# Altium schematic sheet Mini Control Board.SchDoc
size A3; PageSetup: Record=PageOptions|CenterHorizontal=True|CenterVertical=True|PrintScale=0.70|XCorrection=1.00|YCorrection=1.00|PrintKind=0|BorderSize=5000000|LeftOffset=0|BottomOffset=0|Orientation=2|PaperLength=1000|PaperWidth=1000|Scale=100|PaperSource=7|PrintQuality=-3|MediaType=1|DitherType=10|PrintScaleMode=1|PaperKind=Letter|PaperIndex=1
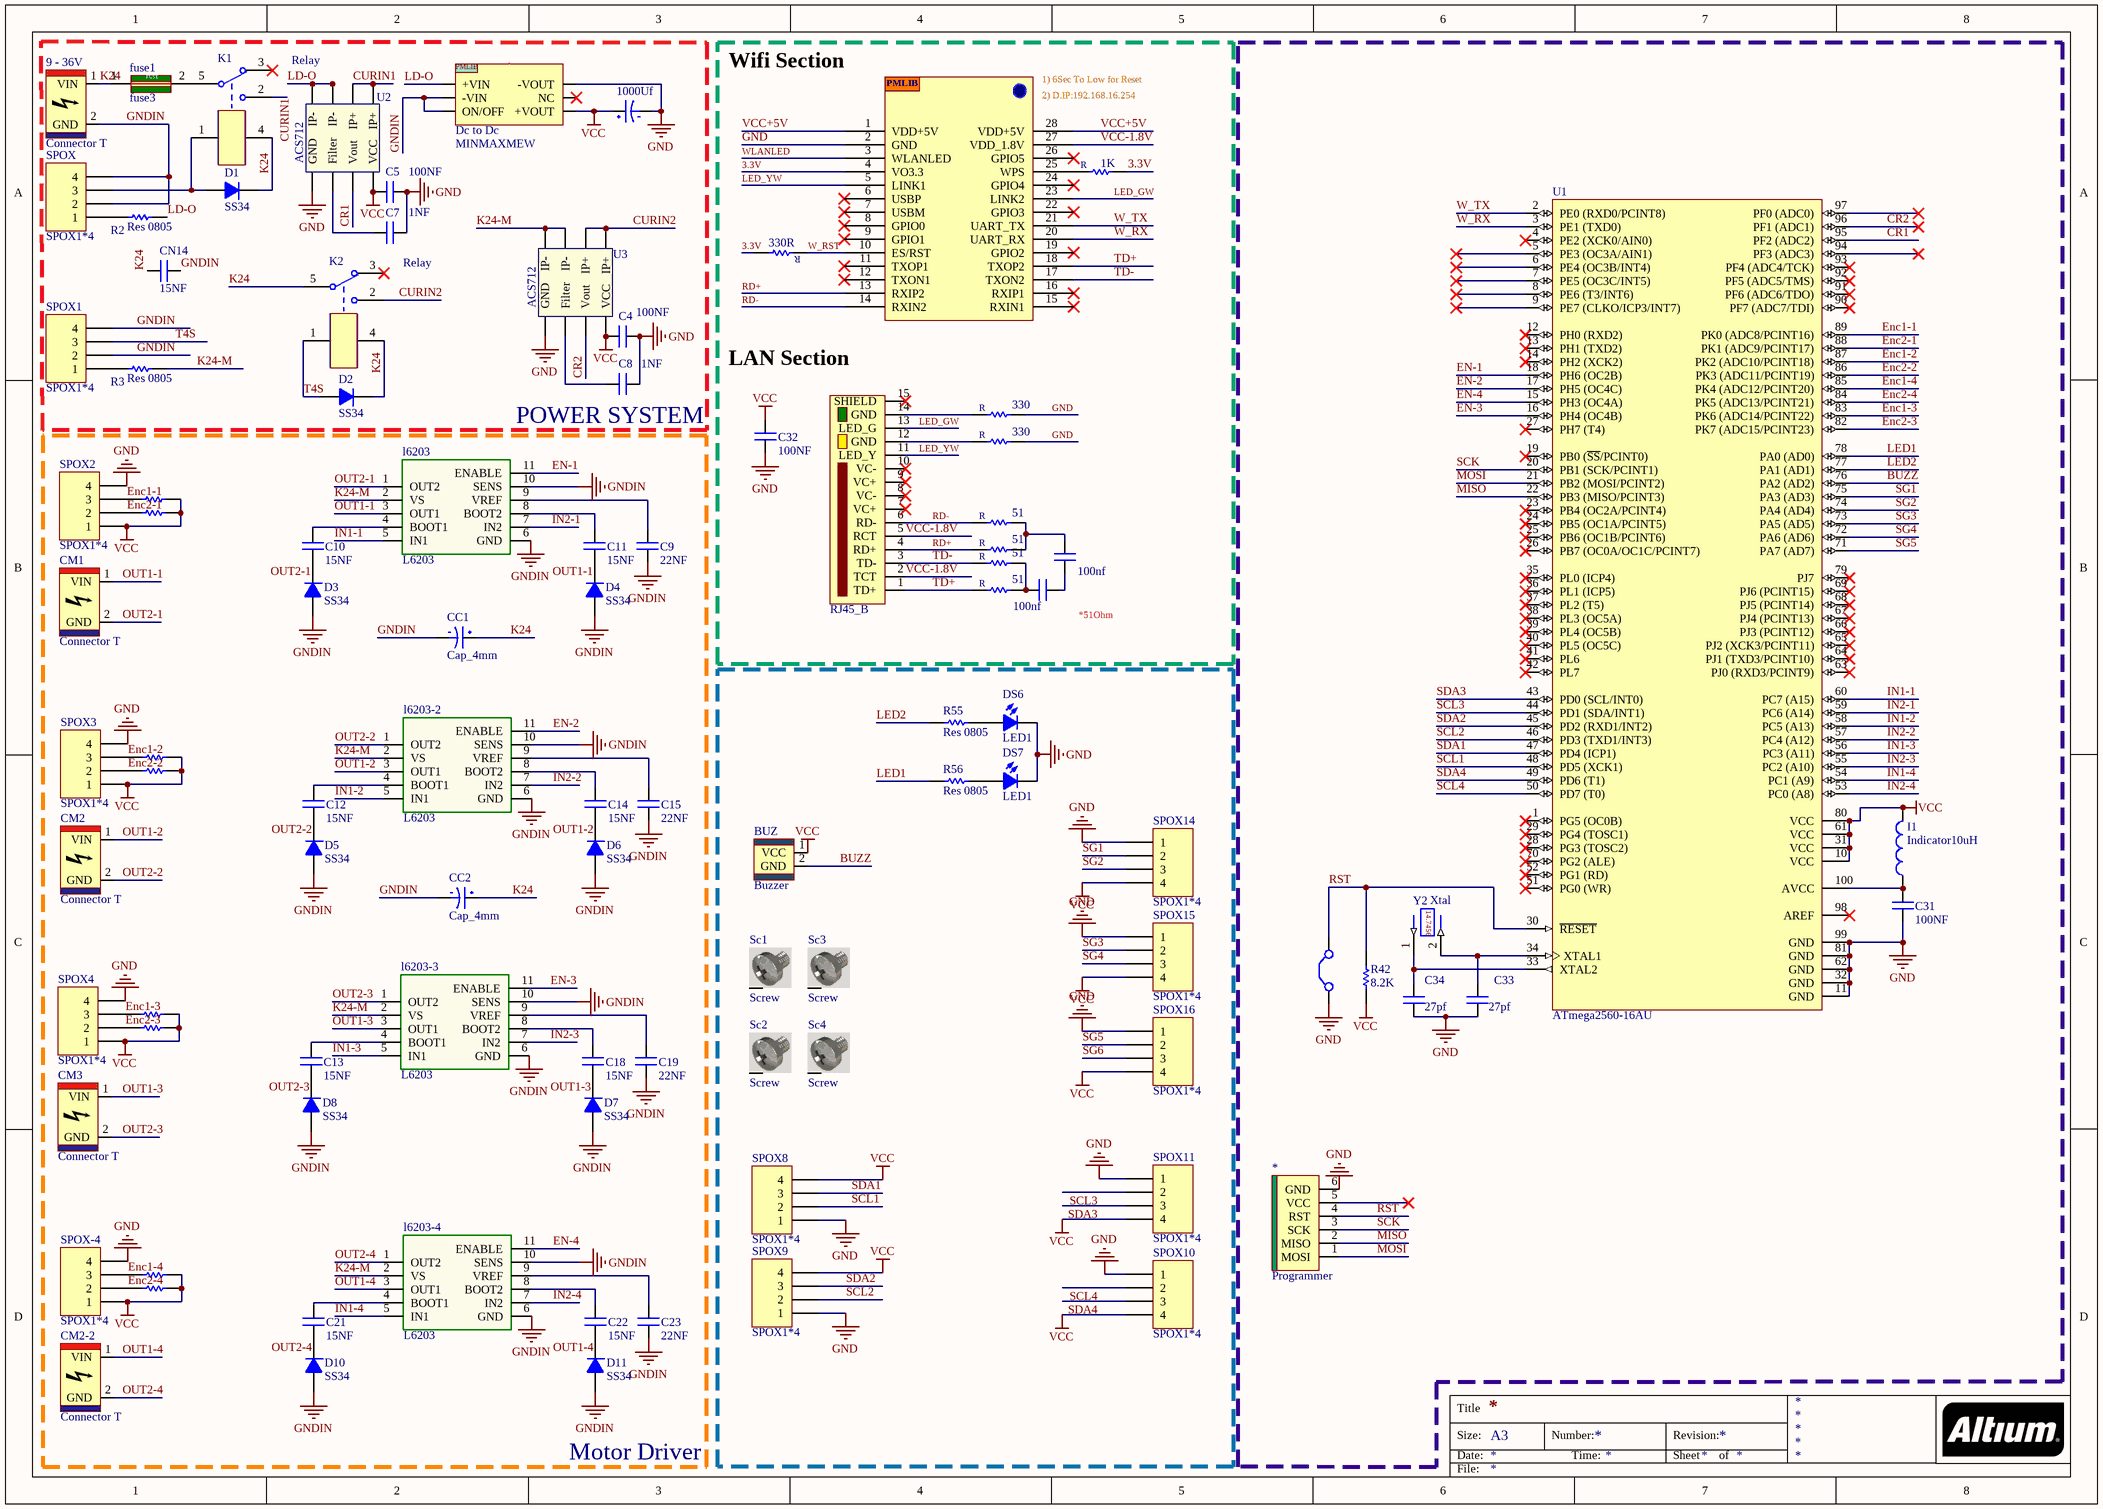
[diagram p0: Mini Control Board.SchDoc]

## Parts
3  HLK_WifiModule  [HLK]  (value not drawn)
9_-_36V  Connector T  [T_Connector]
34  330  [R0805]
35  330R  [R0805]
43  330  [R0805]
89  RJ45_B  [RJ45_B]
1000Uf  Cap_4mm  [Cap_4mm]  (value not drawn)
*  Programmer  [Programmer]
BUZ  Buzzer  [Buzzer]
C4  100NF  [Cap0805]
C5  100NF  [Cap0805]
C7  1NF  [Cap0805]
C8  1NF  [Cap0805]
C9  22NF  [Cap0805]
C10  15NF  [Cap0805]
C11  15NF  [Cap0805]
C12  15NF  [Cap0805]
C13  15NF  [Cap0805]
C14  15NF  [Cap0805]
C15  22NF  [Cap0805]
C18  15NF  [Cap0805]
C19  22NF  [Cap0805]
C21  15NF  [Cap0805]
C22  15NF  [Cap0805]
C23  22NF  [Cap0805]
C31  100NF  [Cap0805]
C32  100NF  [Cap0805]
C33  27pf  [Cap0805]
C34  27pf  [Cap0805]
C93  100nf  [Cap0805]
C94  100nf  [Cap0805]
CC1  Cap_4mm  [Cap_5mm]
CC2  Cap_4mm  [Cap_5mm]
CM1  Connector T  [T_Connector]
CM2  Connector T  [T_Connector]
CM2-2  Connector T  [T_Connector]
CM3  Connector T  [T_Connector]
CN14  15NF  [Cap0805]
D1  SS34  [Diod-1A-SMD]
D2  SS34  [Diod-1A-SMD]
D3  SS34  [Diod-1A-SMD]
D4  SS34  [Diod-1A-SMD]
D5  SS34  [Diod-1A-SMD]
D6  SS34  [Diod-1A-SMD]
D7  SS34  [Diod-1A-SMD]
D8  SS34  [Diod-1A-SMD]
D10  SS34  [Diod-1A-SMD]
D11  SS34  [Diod-1A-SMD]
Dc_to_Dc  MINMAXMEW  [MINMAXMEW]
DS6  LED1  [LED_SMD0805RED]
DS7  LED1  [LED_SMD0805RED]
fdcg3  Jumper  [Jumper]  (value not drawn)
fuse1  fuse3  [fuse_SMD0805]
I1  Indicator10uH  [1206]
K1  Relay  [RelayMilionMiniS-Z]
K2  Relay  [RelayMilionMiniS-Z]
l6203  L6203  [L6203]
l6203-2  L6203  [L6203]
l6203-3  L6203  [L6203]
l6203-4  L6203  [L6203]
PO  51  [R0805]
POS  51  [R0805]
POS2  51  [R0805]
POS3  51  [R0805]
POSWW  1K  [R0805]
R2  Res 0805  [R0805]
R3  Res 0805  [R0805]
R8  Res 0805  [R0805]  (value not drawn)
R9  Res 0805  [R0805]  (value not drawn)
R12  Res 0805  [R0805]  (value not drawn)
R13  Res 0805  [R0805]  (value not drawn)
R16  Res 0805  [R0805]  (value not drawn)
R17  Res 0805  [R0805]  (value not drawn)
R25  Res 0805  [R0805]  (value not drawn)
r26  Res 0805  [R0805]  (value not drawn)
R42  8.2K  [R0805]
R55  Res 0805  [R0805]
R56  Res 0805  [R0805]
Sc1  Screw  [Screw]
Sc2  Screw  [Screw]
Sc3  Screw  [Screw]
Sc4  Screw  [Screw]
SPOX  SPOX1*4  [SPOX_1*4RIGHT]
SPOX1  SPOX1*4  [SPOX_1*4RIGHT]
SPOX2  SPOX1*4  [SPOX_1*4RIGHT]
SPOX3  SPOX1*4  [SPOX_1*4RIGHT]
SPOX4  SPOX1*4  [SPOX_1*4RIGHT]
SPOX8  SPOX1*4  [SPOX_1*4RIGHT]
SPOX9  SPOX1*4  [SPOX_1*4RIGHT]
SPOX10  SPOX1*4  [SPOX_1*4RIGHT]
SPOX11  SPOX1*4  [SPOX_1*4RIGHT]
SPOX14  SPOX1*4  [SPOX_1*4RIGHT]
SPOX15  SPOX1*4  [SPOX_1*4RIGHT]
SPOX16  SPOX1*4  [SPOX_1*4RIGHT]
SPOX-4  SPOX1*4  [SPOX_1*4RIGHT]
U1  ATmega2560-16AU  [100A_N]
U2  ACS712  [SOP8]
U3  ACS712  [SOP8]
Y2  Xtal  [Crystal]

## Blocks framed on the sheet
POWER SYSTEM: 9_-_36V 1000Uf C4 C5 C7 C8 CN14 D1 D2 Dc_to_Dc fuse1 K1 K2 R2 R3 SPOX SPOX1 U2 U3
Motor Driver: C9-C15 C18 C19 C21-C23 CC1 CC2 CM1 CM2 CM2-2 CM3 D3-D8 D10 D11 l6203 l6203-2-l6203-4 R8 R9 R12 R13 R16 R17 R25 r26 SPOX2-SPOX4 SPOX-4

## Nets
GND: 3.2(GND) 34.1 43.1 1000Uf.1 *.6(GND) C4.2 C5.2 C7.2 C8.2 C31.1 C32.1 C33.1 C34.1 Dc_to_Dc.7(-VOUT) DS6.K DS7.K fdcg3.1(C1) SPOX2.4 SPOX3.4 SPOX4.4 SPOX8.1 SPOX9.1 SPOX10.1 SPOX11.1 SPOX14.1 SPOX15.1 SPOX16.1 SPOX-4.4 U1.11(GND) U1.32(GND) U1.62(GND) U1.81(GND) U1.99(GND) U2.5(GND) U3.5(GND)
GNDIN: 9_-_36V.2(GND) C9.2 C15.2 C19.2 C23.2 CC1.1 CC2.1 CN14.2 D3.A D4.A D5.A D6.A D7.A D8.A D10.A D11.A Dc_to_Dc.1(-VIN) Dc_to_Dc.3(ON/OFF) l6203.6(GND) l6203.10(SENS) l6203-2.6(GND) l6203-2.10(SENS) l6203-3.6(GND) l6203-3.10(SENS) l6203-4.6(GND) l6203-4.10(SENS) SPOX.2 SPOX.4 SPOX1.2 SPOX1.4
VCC: 1000Uf.2 BUZ.1(VCC) C4.1 C5.1 C32.2 Dc_to_Dc.6(+VOUT) I1.2 R8.1 R9.1 R12.1 R13.1 R16.1 R17.1 R25.1 r26.1 R42.2 SPOX2.1 SPOX3.1 SPOX4.1 SPOX8.4 SPOX9.4 SPOX10.4 SPOX11.4 SPOX14.4 SPOX15.4 SPOX16.4 SPOX-4.1 U1.10(VCC) U1.31(VCC) U1.61(VCC) U1.80(VCC) U2.8(VCC) U3.8(VCC)
3.3V: 3.4(VO3.3) 35.1 POSWW.1
BUZZ: BUZ.2(GND) U1.76(PA2_(AD2))
CR1: U1.95(PF2_(ADC2)) U2.7(Vout)
CR2: U1.96(PF1_(ADC1)) U3.7(Vout)
CURIN1: K1.2 U2.1(IP+) U2.2(IP+)
CURIN2: K2.2 U3.1(IP+) U3.2(IP+)
EN-1: l6203.11(ENABLE) U1.18(PH6_(OC2B))
EN-2: l6203-2.11(ENABLE) U1.17(PH5_(OC4C))
EN-3: l6203-3.11(ENABLE) U1.16(PH4_(OC4B))
EN-4: l6203-4.11(ENABLE) U1.15(PH3_(OC4A))
Enc1-1: R8.2 SPOX2.3 U1.89(PK0_(ADC8/PCINT16))
Enc1-2: R13.2 SPOX3.3 U1.87(PK2_(ADC10/PCINT18))
Enc1-3: R16.2 SPOX4.3 U1.83(PK6_(ADC14/PCINT22))
Enc1-4: R25.2 SPOX-4.3 U1.85(PK4_(ADC12/PCINT20))
Enc2-1: R9.2 SPOX2.2 U1.88(PK1_(ADC9/PCINT17))
Enc2-2: R12.2 SPOX3.2 U1.86(PK3_(ADC11/PCINT19))
Enc2-3: R17.2 SPOX4.2 U1.82(PK7_(ADC15/PCINT23))
Enc2-4: r26.2 SPOX-4.2 U1.84(PK5_(ADC13/PCINT21))
IN1-1: l6203.5(IN1) U1.60(PC7_(A15))
IN1-2: l6203-2.5(IN1) U1.58(PC5_(A13))
IN1-3: l6203-3.5(IN1) U1.56(PC3_(A11))
IN1-4: l6203-4.5(IN1) U1.54(PC1_(A9))
IN2-1: l6203.7(IN2) U1.59(PC6_(A14))
IN2-2: l6203-2.7(IN2) U1.57(PC4_(A12))
IN2-3: l6203-3.7(IN2) U1.55(PC2_(A10))
IN2-4: l6203-4.7(IN2) U1.53(PC0_(A8))
K24: 9_-_36V.1(VIN) CC1.2 CC2.2 CN14.1 D1.K D2.K fuse1.1(IN) K1.4 K2.4 K2.5
K24-M: l6203.2(VS) l6203-2.2(VS) l6203-3.2(VS) l6203-4.2(VS) R3.1 U3.3(IP-) U3.4(IP-)
LD-O: Dc_to_Dc.2(+VIN) R2.1 U2.3(IP-) U2.4(IP-)
LED1: R56.2 U1.78(PA0_(AD0))
LED2: R55.2 U1.77(PA1_(AD1))
LED_GW: 3.23(LINK2) 89.13(LED_G)
LED_YW: 3.5(LINK1) 89.11(LED_Y)
MISO: *.2(MISO) U1.22(PB3_(MISO/PCINT3))
MOSI: *.1(MOSI) U1.21(PB2_(MOSI/PCINT2))
OUT1-1: C11.2 CM1.1(VIN) D4.K l6203.3(OUT1)
OUT1-2: C14.2 CM2.1(VIN) D6.K l6203-2.3(OUT1)
OUT1-3: C18.2 CM3.1(VIN) D7.K l6203-3.3(OUT1)
OUT1-4: C22.2 CM2-2.1(VIN) D11.K l6203-4.3(OUT1)
OUT2-1: C10.2 CM1.2(GND) D3.K l6203.1(OUT2)
OUT2-2: C12.2 CM2.2(GND) D5.K l6203-2.1(OUT2)
OUT2-3: C13.2 CM3.2(GND) D8.K l6203-3.1(OUT2)
OUT2-4: C21.2 CM2-2.2(GND) D10.K l6203-4.1(OUT2)
RD+: 3.13(RXIP2) 89.4(RD+) POS3.2
RD-: 3.14(RXIN2) 89.6(RD-) POS2.2
RST: *.4(RST) fdcg3.2(C2) R42.1 U1.30(~{RESET})
SCK: *.3(SCK) U1.20(PB1_(SCK/PCINT1))
SCL1: SPOX8.2 U1.48(PD5_(XCK1))
SCL2: SPOX9.2 U1.46(PD3_(TXD1/INT3))
SCL3: SPOX11.2 U1.44(PD1_(SDA/INT1))
SCL4: SPOX10.2 U1.50(PD7_(T0))
SDA1: SPOX8.3 U1.47(PD4_(ICP1))
SDA2: SPOX9.3 U1.45(PD2_(RXD1/INT2))
SDA3: SPOX11.3 U1.43(PD0_(SCL/INT0))
SDA4: SPOX10.3 U1.49(PD6_(T1))
SG1: SPOX14.2 U1.75(PA3_(AD3))
SG2: SPOX14.3 U1.74(PA4_(AD4))
SG3: SPOX15.2 U1.73(PA5_(AD5))
SG4: SPOX15.3 U1.72(PA6_(AD6))
SG5: SPOX16.2 U1.71(PA7_(AD7))
SG6: SPOX16.3
T4S: D2.A K2.1 SPOX1.3
TD+: 3.18(TXOP2) 89.1(TD+) PO.2
TD-: 3.17(TXON2) 89.3(TD-) POS.2
VCC+5V: 3.1(VDD+5V) 3.28(VDD+5V)
VCC-1.8V: 3.27(VDD_1.8V) 89.2(TCT) 89.5(RCT)
W_RST: 3.10(ES/RST) 35.2
W_RX: 3.20(UART_RX) U1.3(PE1_(TXD0))
W_TX: 3.21(UART_TX) U1.2(PE0_(RXD0/PCINT8))
WLANLED: 3.3(WLANLED)
Net3_25: 3.25(WPS) POSWW.2
Net34_2: 34.2 89.14(GND)
Net43_2: 43.2 89.12(GND)
NetC7_1: C7.1 U2.6(Filter)
NetC8_1: C8.1 U3.6(Filter)
NetC9_1: C9.1 l6203.9(VREF)
NetC10_1: C10.1 l6203.4(BOOT1)
NetC11_1: C11.1 l6203.8(BOOT2)
NetC12_1: C12.1 l6203-2.4(BOOT1)
NetC13_1: C13.1 l6203-3.4(BOOT1)
NetC14_1: C14.1 l6203-2.8(BOOT2)
NetC15_1: C15.1 l6203-2.9(VREF)
NetC18_1: C18.1 l6203-3.8(BOOT2)
NetC19_1: C19.1 l6203-3.9(VREF)
NetC21_1: C21.1 l6203-4.4(BOOT1)
NetC22_1: C22.1 l6203-4.8(BOOT2)
NetC23_1: C23.1 l6203-4.9(VREF)
NetC31_2: C31.2 I1.1 U1.100(AVCC)
NetC33_2: C33.2 U1.34(XTAL1) Y2.2
NetC34_2: C34.2 U1.33(XTAL2) Y2.1
NetC93_1: C93.1 C94.1
NetC93_2: C93.2 PO.1 POS.1
NetC94_2: C94.2 POS2.1 POS3.1
NetD1_A: D1.A K1.1 SPOX.3
NetDS6_A: DS6.A R55.1
NetDS7_A: DS7.A R56.1
Netfuse1_2: fuse1.2(OUT) K1.5
NetR2_2: R2.2 SPOX.1
NetR3_2: R3.2 SPOX1.1

Not connected (* = marked no-connect by the designer): 3 6(USBP)* 7(USBM)* 8(GPIO0)* 9(GPIO1)* 11(TXOP1)* 12(TXON1)* 15(RXIN1)* 16(RXIP1)* 19(GPIO2)* 22(GPIO3)* 24(GPIO4)* 26(GPIO5)*; 89 7(VC+)* 8(VC-)* 9(VC+)* 10(VC-)* 15(SHIELD)*; * 5(VCC)*; Dc_to_Dc 5(NC)* 8(NC); K1 3*; K2 3*; Sc1 S; Sc2 S; Sc3 S; Sc4 S; U1 1(PG5_(OC0B))* 4(PE2_(XCK0/AIN0))* 5(PE3_(OC3A/AIN1))* 6(PE4_(OC3B/INT4))* 7(PE5_(OC3C/INT5))* 8(PE6_(T3/INT6))* 9(PE7_(CLKO/ICP3/INT7))* 12(PH0_(RXD2))* 13(PH1_(TXD2))* 14(PH2_(XCK2))* 19(PB0_(~{SS}/PCINT0))* 23(PB4_(OC2A/PCINT4))* 24(PB5_(OC1A/PCINT5))* 25(PB6_(OC1B/PCINT6))* 26(PB7_(OC0A/OC1C/PCINT7))* 27(PH7_(T4))* 28(PG3_(TOSC2))* 29(PG4_(TOSC1))* 35(PL0_(ICP4))* 36(PL1_(ICP5))* 37(PL2_(T5))* 38(PL3_(OC5A))* 39(PL4_(OC5B))* 40(PL5_(OC5C))* 41(PL6)* 42(PL7)* 51(PG0_(WR))* 52(PG1_(RD))* 63(PJ0_(RXD3/PCINT9))* 64(PJ1_(TXD3/PCINT10))* 65(PJ2_(XCK3/PCINT11))* 66(PJ3_(PCINT12))* 67(PJ4_(PCINT13))* 68(PJ5_(PCINT14))* 69(PJ6_(PCINT15))* 70(PG2_(ALE))* 79(PJ7)* 90(PF7_(ADC7/TDI))* 91(PF6_(ADC6/TDO))* 92(PF5_(ADC5/TMS))* 93(PF4_(ADC4/TCK))* 94(PF3_(ADC3))* 97(PF0_(ADC0))* 98(AREF)*

## Notes on the sheet
- Wifi Section
- (near 3) 1) 6Sec To Low for Reset
- (near 3) 2) D.IP:192.168.16.254
- LAN Section
- *51Ohm
- Title
- Size:
- Date:
- A3
- Number:
- Time:
- Revision:
- Sheet
- of
- File:
- (in symbol Crystal) 14.7456
- (in symbol fuse3) FUSE
- (in symbol HLK_WifiModule) PMLIB
- (in symbol MINMAXMEW) PMLIB
- (in symbol R0805) R

## Library data of the parts
34 35 43 PO POS POS2 POS3 POSWW = R0805
1000Uf CC1 CC2 = Cap_Pola
C4 C5 C7-C15 C18 C19 C21-C23 C31-C34 C93 C94 CN14 = Cap0805: surface mount capacitor (size 805)
D1-D8 D10 D11 = Diode
I1 = Indicator100uH
K1 K2 = RelayMilon
R42 = Res 0805
U1 = ATmega2560-16AU: 8-bit AVR Microcontroller, 4.5-5.5V, 16MHz, 256KB Flash, 4KB EEPROM, 8KB SRAM, 86 GPIO pins, 100-pin TQFP, Industrial Grade (-40°C to 85°C), Pb-Free; DatasheetVersion: revN, May-2011; PackageVersion: revD, Oct-2010; PackageReference: 100A; PackageDescription: 100-Pin Thin Profile Plastic Quad Flat Pack (TQFP), 14 x 14 x 1.0 mm Body, 0.5 mm Pitch; Code_JEDEC: MS-026-AED; ComponentLink1Description: Manufacturer URL; ComponentLink1URL: http://www.atmel.com/; ComponentLink2Description: ATmega640/1280/1281/2560/2561 Datasheet; ComponentLink2URL: http://www.atmel.com/dyn/resources/prod_documents/doc2549.pdf; ComponentLink3Description: ATmega640/1280/1281/2560/2561 Summary; ComponentLink3URL: http://www.atmel.com/dyn/resources/prod_documents/2549S.pdf
U2 U3 = ACS712: Hall effect Current Sensor
Y2 = Crystal